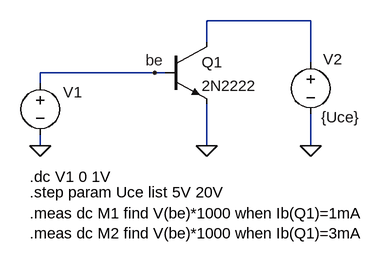
[diagram p0: schematic BT-CE-IN-2.asc]
BT-CE-IN-2.asc, the LTspice schematic file:
Version 4
SHEET 1 880 680
WIRE 448 32 288 32
WIRE 288 64 288 32
WIRE 448 96 448 32
WIRE 208 112 32 112
WIRE 224 112 208 112
WIRE 32 128 32 112
WIRE 32 224 32 208
WIRE 288 224 288 160
WIRE 448 224 448 176
FLAG 288 224 0
FLAG 32 224 0
FLAG 448 224 0
FLAG 208 112 be
SYMBOL voltage 32 112 R0
WINDOW 3 24 32 Invisible 2
WINDOW 123 0 0 Left 2
WINDOW 39 0 0 Left 2
WINDOW 0 35 30 Left 2
SYMATTR Value 0
SYMATTR InstName V1
SYMBOL npn 224 64 R0
SYMATTR InstName Q1
SYMATTR Value 2N2222
SYMBOL voltage 448 80 R0
WINDOW 3 16 100 Left 2
WINDOW 123 0 0 Left 2
WINDOW 39 0 0 Left 2
WINDOW 0 19 11 Left 2
SYMATTR Value {Uce}
SYMATTR InstName V2
TEXT 16 272 Left 2 !.dc V1 0 1V
TEXT 16 328 Left 2 !.meas dc M1 find V(be)*1000 when Ib(Q1)=1mA\n.meas dc M2 find V(be)*1000 when Ib(Q1)=3mA
TEXT 16 296 Left 2 !.step param Uce list 5V 20V

The netlist it stands for:
* BT-CE-IN-2.asc
V1 be 0 0
Q1 N001 be 0 0 2N2222
V2 N001 0 {Uce}
.model NPN NPN
.model PNP PNP
.lib standard.bjt
.dc V1 0 1V
.meas dc M1 find V(be)*1000 when Ib(Q1)=1mA
.meas dc M2 find V(be)*1000 when Ib(Q1)=3mA
.step param Uce list 5V 20V
.backanno
.end